# Altium project L298N Motor Driver Module.PrjPcb
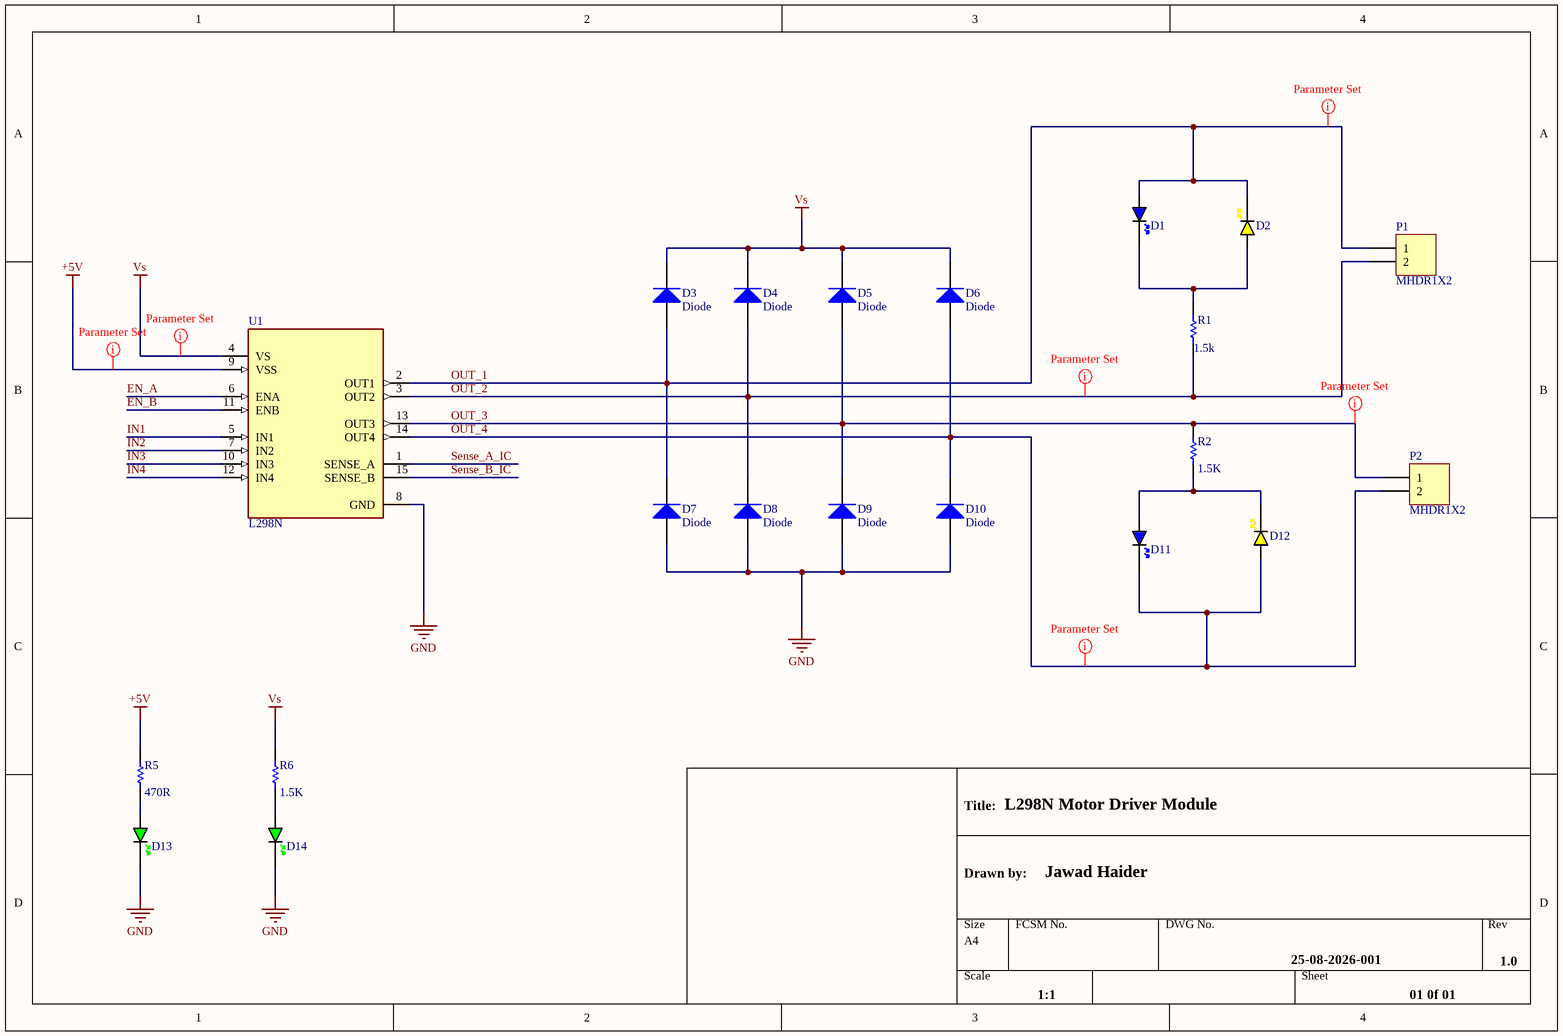
[diagram p0: L298N Motor Driver Module Schematic.SchDoc]
3 sheets, 32 parts. Net scope: global (net labels, ports and power ports of the same name join across sheets).
Board file: L298N Motor Driver Module PCB.PcbDoc
Sheets:
  L298N Motor Driver Module Schematic.SchDoc
  Power Suppy Schematic.SchDoc
  Connectors and Headers.SchDoc

## Sheet L298N Motor Driver Module Schematic.SchDoc
size A4; SheetNumber: 1; SheetTotal: 3

### Parts
D1  BLUE  [LED_0603_BLUE]  (value not drawn)
D2  YELLOW  [LED_0603_YELLOW]  (value not drawn)
D3  Diode  [Diode_M7_SMA]
D4  Diode  [Diode_M7_SMA]
D5  Diode  [Diode_M7_SMA]
D6  Diode  [Diode_M7_SMA]
D7  Diode  [Diode_M7_SMA]
D8  Diode  [Diode_M7_SMA]
D9  Diode  [Diode_M7_SMA]
D10  Diode  [Diode_M7_SMA]
D11  BLUE  [LED_0603_BLUE]  (value not drawn)
D12  YELLOW  [LED_0603_YELLOW]  (value not drawn)
D13  GREEN  [LED_0603_GREEN]  (value not drawn)
D14  GREEN  [LED_0603_GREEN]  (value not drawn)
P1  MHDR1X2  [Terminal block 2 pin 5.08mm]
P2  MHDR1X2  [Terminal block 2 pin 5.08mm]
R1  value 1.5k  [RES_0603]  (hidden comment: Res1)
R2  value 1.5K  [RES_0603]  (hidden comment: Res1)
R5  value 470R  [RES_0603]  (hidden comment: Res1)
R6  value 1.5K  [RES_0603]  (hidden comment: Res1)
U1  L298N  [TO127P2020X500X2100-15]

### Nets
+5V: R5.2 U1.9(VSS)
GND: D7.1(A) D8.1(A) D9.1(A) D10.1(A) D13.K D14.K U1.8(GND)
Vs: D3.2(K) D4.2(K) D5.2(K) D6.2(K) R6.2 U1.4(VS)
EN_A: U1.6(ENA)
EN_B: U1.11(ENB)
IN1: U1.5(IN1)
IN2: U1.7(IN2)
IN3: U1.10(IN3)
IN4: U1.12(IN4)
OUT_1: D1.A D2.K D3.1(A) D7.2(K) P1.1 U1.2(OUT1)
OUT_2: D4.1(A) D8.2(K) P1.2 R1.1 U1.3(OUT2)
OUT_3: D5.1(A) D9.2(K) P2.1 R2.2 U1.13(OUT3)
OUT_4: D6.1(A) D10.2(K) D11.K D12.A P2.2 U1.14(OUT4)
Sense_A_IC: U1.1(SENSE_A)
Sense_B_IC: U1.15(SENSE_B)
NetD1_K: D1.K D2.A R1.2
NetD11_A: D11.A D12.K R2.1
NetD13_A: D13.A R5.1
NetD14_A: D14.A R6.1

### Layout directives
net class Power: OUT_1, OUT_2, OUT_3, OUT_4, Vs
net class +5V Rail: +5V

### Notes on the sheet
- Title:
- L298N Motor Driver Module
- Drawn by:
- Jawad Haider
- 25-08-2026-001
- 1.0
- 1:1
- 01 0f 01
- Size:
- Date:
- Title
- A4
- Number:
- Time:
- Revision:
- Sheet
- of
- Engineer
- File:

### Library data of the parts
D1 D11 = LED_0603_BLUE: LED 0603 BLUE SMD
D2 D12 = LED_0603_YELLOW: LED 0603 YELLOW SMD
D3-D10 = Diode: Default Diode; Published: 8-Jun-2000; LatestRevisionDate: 17-Jul-2002; LatestRevisionNote: Re-released for DXP Platform.; PackageVersion: Sep-1996; PackageReference: SMC; Publisher: Altium Limited; PackageDescription: DO-214-AB/SMC; 2 C-Bend Leads; Body 7.9 x 5.9 mm, inc. leads (LxW); Code_JEDEC: DO-214-AB
D13 D14 = LED_0603_GREEN: LED 0603 GREEN SMD
P1 P2 = MHDR1X2: Header, 2-Pin; LatestRevisionDate: 17-Jul-2002; LatestRevisionNote: Re-released for DXP Platform.; Publisher: Altium Limited
R1 R2 R5 R6 = Res1: Resistor; Published: 8-Jun-2000; LatestRevisionDate: 17-Jul-2002; LatestRevisionNote: Re-released for DXP Platform.; PackageReference: AXIAL-0.3; Publisher: Altium Limited; PackageDescription: Axial Device, Thru-Hole; 2 Leads; 0.3 in Pin Spacing
U1 = L298N: Dual Full Bridge Motor Driver 15-Pin(15+Tab) MULTIWATT V Tube; MP: L298N; Availability: Unavailable; Package: None; Value: *; Price: None

## Sheet Power Suppy Schematic.SchDoc
size A4; SheetNumber: 2; SheetTotal: 3
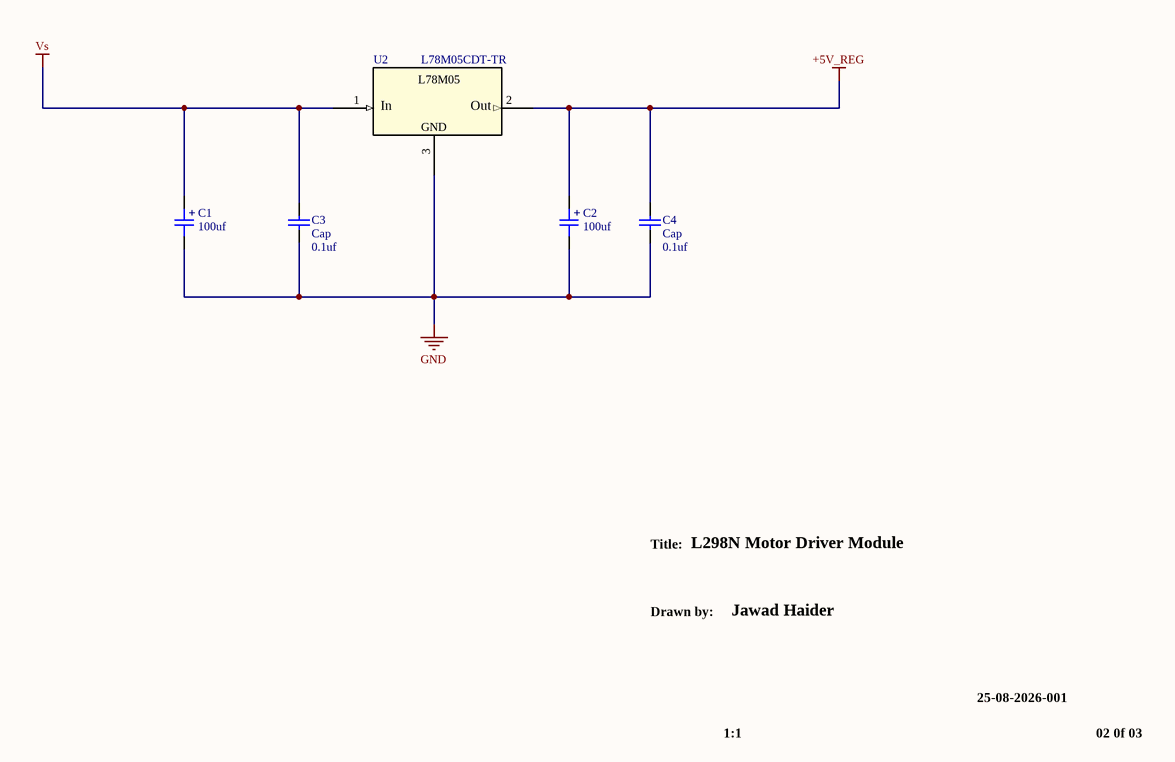
[diagram p1: Power Suppy Schematic.SchDoc]

### Parts
C1  100uf  [CAP_AE_SMD_D6MM3_H5M55]
C2  100uf  [CAP_AE_SMD_D6MM3_H5M55]
C3  Cap  value 0.1uf  [CAP_0603]
C4  Cap  value 0.1uf  [CAP_0603]
U2  L78M05CDT-TR  [DPAK_STM]

### Nets
+5V_REG: C2.1 C4.2 U2.2(OUTPUT)
GND: C1.2 C2.2 C3.1 C4.1 U2.3(GROUND)
Vs: C1.1 C3.2 U2.1(INPUT)

### Notes on the sheet
- Title:
- L298N Motor Driver Module
- Drawn by:
- Jawad Haider
- 25-08-2026-001
- 1:1
- 02 0f 03
- (in symbol CAP_ALEL_6.3x5.5) +
- (in symbol L78M05CDT-TR) L78M05; In; Out; GND

### Library data of the parts
C1 C2 = CAP_ALEL_6.3x5.5: Capacitor SMD Aluminium Electrolytic 6.3mm Diameter 5.5mm Height; Manufacturer: *; Manufacturer Part Number: *; Distributor Link: *; LCSC: *
C3 C4 = Cap: Capacitor; Published: 8-Jun-2000; LatestRevisionDate: 17-Jul-2002; LatestRevisionNote: Re-released for DXP Platform.; PackageReference: RAD-0.3; Publisher: Altium Limited; PackageDescription: Radial Cap, Thru-Hole; 2 Leads; 0.3 in Pin Spacing
U2 = L78M05CDT-TR: Precision 500 mA regulators; Manufacturer_Name: STMicroelectronics; Copyright: Copyright (C) 2025 Ultra Librarian. All rights reserved.; Manufacturer_Part_Number: L78M05CDT-TR; RefDes: RefDes; Type: Type

## Sheet Connectors and Headers.SchDoc
size A4; SheetNumber: 3; SheetTotal: 3
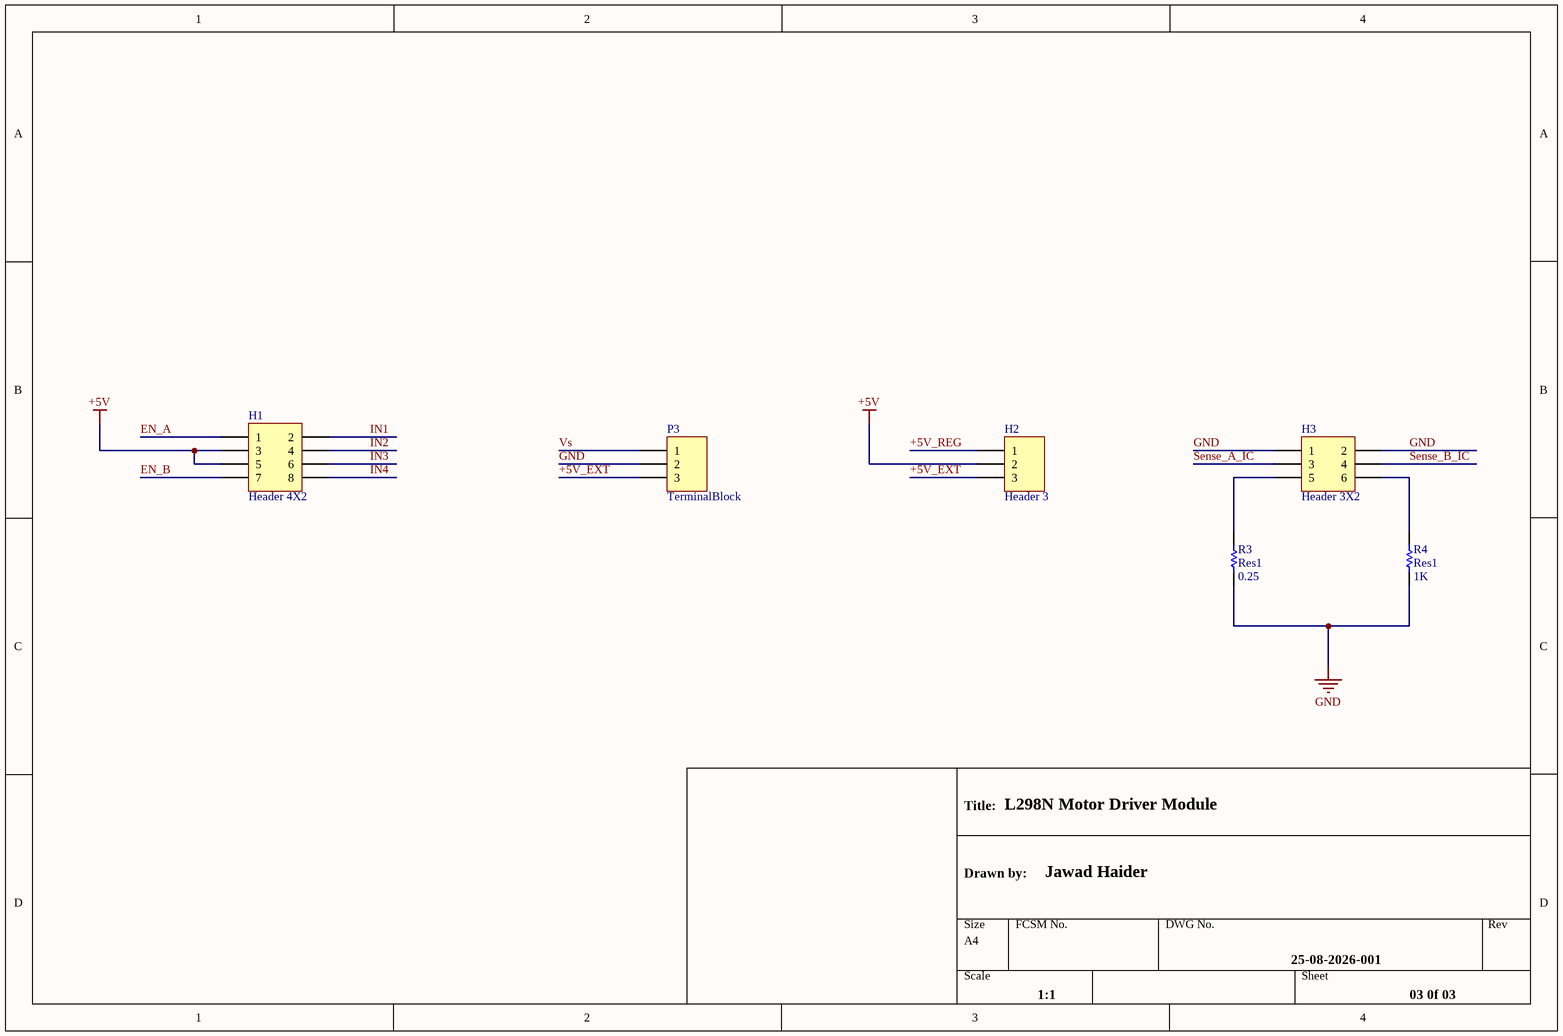
[diagram p2: Connectors and Headers.SchDoc]

### Parts
H1  Header 4X2  [Header 2x4 2.54mm]
H2  Header 3  [Header_1x3_2.54mm]
H3  Header 3X2  [Header 2x3 2.54mm]
P3  TerminalBlock  [TERMINAL BLOCK 3 PIN 5.08MM]
R3  Res1  value 0.25  [RES_1206]
R4  Res1  value 1K  [RES_1206]

### Nets
+5V: H1.3 H1.5 H2.2
+5V_REG: H2.1
GND: H3.1 H3.2 P3.2 R3.1 R4.1
Vs: P3.1
+5V_EXT: H2.3 P3.3
EN_A: H1.1
EN_B: H1.7
IN1: H1.2
IN2: H1.4
IN3: H1.6
IN4: H1.8
Sense_A_IC: H3.3
Sense_B_IC: H3.4
NetH3_5: H3.5 R3.2
NetH3_6: H3.6 R4.2

### Notes on the sheet
- Title:
- L298N Motor Driver Module
- Drawn by:
- Jawad Haider
- 25-08-2026-001
- 1:1
- 03 0f 03

### Library data of the parts
H1 = Header 4X2: Header, 4-Pin, Dual row; LatestRevisionDate: 17-Jul-2002; LatestRevisionNote: Re-released for DXP Platform.; Publisher: Altium Limited
H2 P3 = Header 3: Header, 3-Pin; LatestRevisionDate: 17-Jul-2002; LatestRevisionNote: Re-released for DXP Platform.; Publisher: Altium Limited
H3 = Header 3X2: Header, 3-Pin, Dual row; LatestRevisionDate: 17-Jul-2002; LatestRevisionNote: Re-released for DXP Platform.; Publisher: Altium Limited
R3 R4 = Res1: Resistor; Published: 8-Jun-2000; LatestRevisionDate: 17-Jul-2002; LatestRevisionNote: Re-released for DXP Platform.; PackageReference: AXIAL-0.3; Publisher: Altium Limited; PackageDescription: Axial Device, Thru-Hole; 2 Leads; 0.3 in Pin Spacing

## Nets that join several sheets
+5V: L298N Motor Driver Module Schematic (R5.2 U1.9), Connectors and Headers (H1.3 H1.5 H2.2)
+5V_REG: Power Suppy Schematic (C2.1 C4.2 U2.2), Connectors and Headers (H2.1)
GND: L298N Motor Driver Module Schematic (7 pins), Power Suppy Schematic (5 pins), Connectors and Headers (5 pins)
Vs: L298N Motor Driver Module Schematic (6 pins), Power Suppy Schematic (C1.1 C3.2 U2.1), Connectors and Headers (P3.1)
EN_A: L298N Motor Driver Module Schematic (U1.6), Connectors and Headers (H1.1)
EN_B: L298N Motor Driver Module Schematic (U1.11), Connectors and Headers (H1.7)
IN1: L298N Motor Driver Module Schematic (U1.5), Connectors and Headers (H1.2)
IN2: L298N Motor Driver Module Schematic (U1.7), Connectors and Headers (H1.4)
IN3: L298N Motor Driver Module Schematic (U1.10), Connectors and Headers (H1.6)
IN4: L298N Motor Driver Module Schematic (U1.12), Connectors and Headers (H1.8)
Sense_A_IC: L298N Motor Driver Module Schematic (U1.1), Connectors and Headers (H3.3)
Sense_B_IC: L298N Motor Driver Module Schematic (U1.15), Connectors and Headers (H3.4)